# Altium schematic sheet USB_hub2.SchDoc
size A4
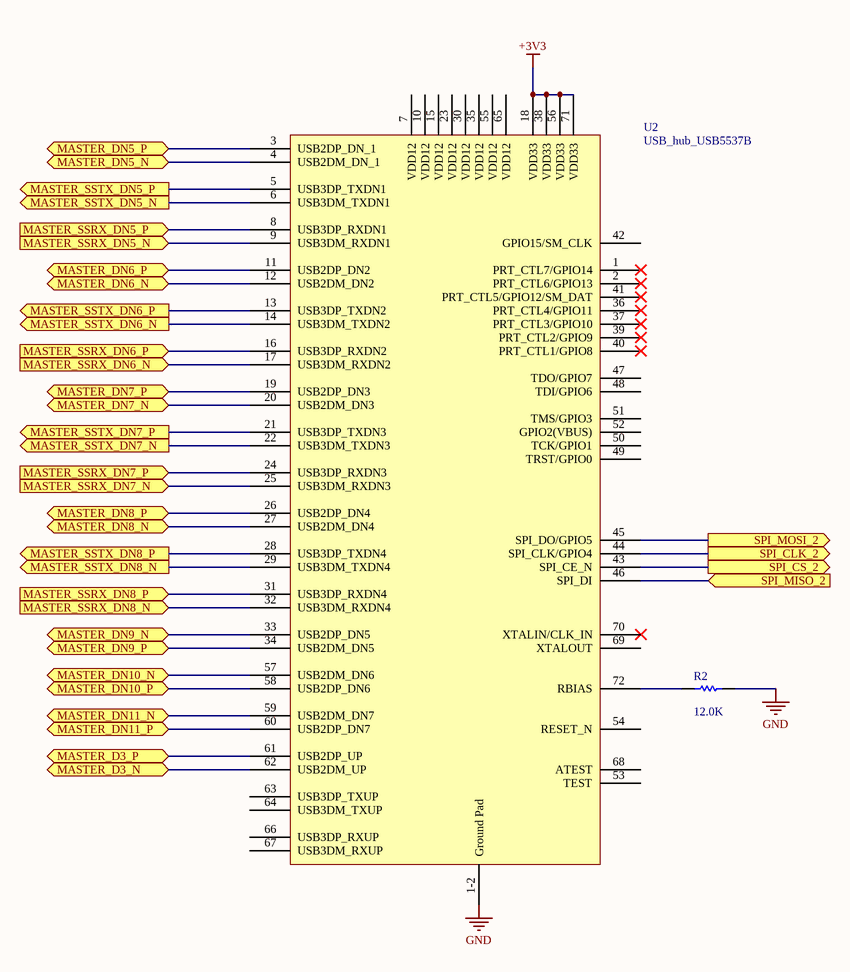
[diagram p0: USB_hub2.SchDoc]

## Parts
R2  value 12.0K  [RESC6332]  (hidden comment: Res1)
U2  USB_hub_USB5537B  [QFN50P1000X1000X100_HS-73N]

## Ports
MASTER_D3_N (bidir), MASTER_D3_P (bidir), MASTER_DN5_N (bidir), MASTER_DN5_P (bidir), MASTER_DN6_N (bidir), MASTER_DN6_P (bidir), MASTER_DN7_N (bidir), MASTER_DN7_P (bidir), MASTER_DN8_N (bidir), MASTER_DN8_P (bidir), MASTER_DN9_N (bidir), MASTER_DN9_P (bidir), MASTER_DN10_N (bidir), MASTER_DN10_P (bidir), MASTER_DN11_N (bidir), MASTER_DN11_P (bidir), MASTER_SSRX_DN5_N (in), MASTER_SSRX_DN5_P (in), MASTER_SSRX_DN6_N (in), MASTER_SSRX_DN6_P (in), MASTER_SSRX_DN7_N (in), MASTER_SSRX_DN7_P (in), MASTER_SSRX_DN8_N (in), MASTER_SSRX_DN8_P (in), MASTER_SSTX_DN5_N (out), MASTER_SSTX_DN5_P (out), MASTER_SSTX_DN6_N (out), MASTER_SSTX_DN6_P (out), MASTER_SSTX_DN7_N (out), MASTER_SSTX_DN7_P (out), MASTER_SSTX_DN8_N (out), MASTER_SSTX_DN8_P (out), SPI_CLK_2 (out), SPI_CS_2 (out), SPI_MISO_2 (in), SPI_MOSI_2 (out)

## Nets
+3V3: U2.18(VDD33) U2.38(VDD33) U2.56(VDD33) U2.71(VDD33)
GND: R2.2 U2.1-2(Ground_Pad)
MASTER_D3_N: U2.62(USB2DM_UP) ; port MASTER_D3_N
MASTER_D3_P: U2.61(USB2DP_UP) ; port MASTER_D3_P
MASTER_DN5_N: U2.4(USB2DM_DN_1) ; port MASTER_DN5_N
MASTER_DN5_P: U2.3(USB2DP_DN_1) ; port MASTER_DN5_P
MASTER_DN6_N: U2.12(USB2DM_DN2) ; port MASTER_DN6_N
MASTER_DN6_P: U2.11(USB2DP_DN2) ; port MASTER_DN6_P
MASTER_DN7_N: U2.20(USB2DM_DN3) ; port MASTER_DN7_N
MASTER_DN7_P: U2.19(USB2DP_DN3) ; port MASTER_DN7_P
MASTER_DN8_N: U2.27(USB2DM_DN4) ; port MASTER_DN8_N
MASTER_DN8_P: U2.26(USB2DP_DN4) ; port MASTER_DN8_P
MASTER_DN9_N: U2.33(USB2DP_DN5) ; port MASTER_DN9_N
MASTER_DN9_P: U2.34(USB2DM_DN5) ; port MASTER_DN9_P
MASTER_DN10_N: U2.57(USB2DM_DN6) ; port MASTER_DN10_N
MASTER_DN10_P: U2.58(USB2DP_DN6) ; port MASTER_DN10_P
MASTER_DN11_N: U2.59(USB2DM_DN7) ; port MASTER_DN11_N
MASTER_DN11_P: U2.60(USB2DP_DN7) ; port MASTER_DN11_P
MASTER_SSRX_DN5_N: U2.9(USB3DM_RXDN1) ; port MASTER_SSRX_DN5_N
MASTER_SSRX_DN5_P: U2.8(USB3DP_RXDN1) ; port MASTER_SSRX_DN5_P
MASTER_SSRX_DN6_N: U2.17(USB3DM_RXDN2) ; port MASTER_SSRX_DN6_N
MASTER_SSRX_DN6_P: U2.16(USB3DP_RXDN2) ; port MASTER_SSRX_DN6_P
MASTER_SSRX_DN7_N: U2.25(USB3DM_RXDN3) ; port MASTER_SSRX_DN7_N
MASTER_SSRX_DN7_P: U2.24(USB3DP_RXDN3) ; port MASTER_SSRX_DN7_P
MASTER_SSRX_DN8_N: U2.32(USB3DM_RXDN4) ; port MASTER_SSRX_DN8_N
MASTER_SSRX_DN8_P: U2.31(USB3DP_RXDN4) ; port MASTER_SSRX_DN8_P
MASTER_SSTX_DN5_N: U2.6(USB3DM_TXDN1) ; port MASTER_SSTX_DN5_N
MASTER_SSTX_DN5_P: U2.5(USB3DP_TXDN1) ; port MASTER_SSTX_DN5_P
MASTER_SSTX_DN6_N: U2.14(USB3DM_TXDN2) ; port MASTER_SSTX_DN6_N
MASTER_SSTX_DN6_P: U2.13(USB3DP_TXDN2) ; port MASTER_SSTX_DN6_P
MASTER_SSTX_DN7_N: U2.22(USB3DM_TXDN3) ; port MASTER_SSTX_DN7_N
MASTER_SSTX_DN7_P: U2.21(USB3DP_TXDN3) ; port MASTER_SSTX_DN7_P
MASTER_SSTX_DN8_N: U2.29(USB3DM_TXDN4) ; port MASTER_SSTX_DN8_N
MASTER_SSTX_DN8_P: U2.28(USB3DP_TXDN4) ; port MASTER_SSTX_DN8_P
SPI_CLK_2: U2.44(SPI_CLK/GPIO4) ; port SPI_CLK_2
SPI_CS_2: U2.43(SPI_CE_N) ; port SPI_CS_2
SPI_MISO_2: U2.46(SPI_DI) ; port SPI_MISO_2
SPI_MOSI_2: U2.45(SPI_DO/GPIO5) ; port SPI_MOSI_2
NetR2_1: R2.1 U2.72(RBIAS)

Not connected (* = marked no-connect by the designer): U2 1(PRT_CTL7/GPIO14)* 2(PRT_CTL6/GPIO13)* 7(VDD12) 10(VDD12) 15(VDD12) 23(VDD12) 30(VDD12) 35(VDD12) 36(PRT_CTL4/GPIO11)* 37(PRT_CTL3/GPIO10)* 39(PRT_CTL2/GPIO9)* 40(PRT_CTL1/GPIO8)* 41(PRT_CTL5/GPIO12/SM_DAT)* 42(GPIO15/SM_CLK) 47(TDO/GPIO7) 48(TDI/GPIO6) 49(TRST/GPIO0) 50(TCK/GPIO1) 51(TMS/GPIO3) 52(GPIO2(VBUS)) 53(TEST) 54(RESET_N) 55(VDD12) 63(USB3DP_TXUP) 64(USB3DM_TXUP) 65(VDD12) 66(USB3DP_RXUP) 67(USB3DM_RXUP) 68(ATEST) 69(XTALOUT) 70(XTALIN/CLK_IN)*

## Library data of the parts
R2 = Res1: Resistor; Published: 8-Jun-2000; LatestRevisionDate: 17-Jul-2002; LatestRevisionNote: Re-released for DXP Platform.; PackageReference: AXIAL-0.3; Publisher: Altium Limited; PackageDescription: Axial Device, Thru-Hole; 2 Leads; 0.3 in Pin Spacing
U2 = USB_hub_USB5537B: https://media.digikey.com/pdf/Data%20Sheets/Microchip%20PDFs/USB5537B.pdf